# Altium schematic sheet Schematic.SchDoc
size A2; Organization: Protel International P/L; Address1: L3, 12a Rodborough Rd; Address2: Frenchs Forest; Address3: NSW; Address4: Australia 2086
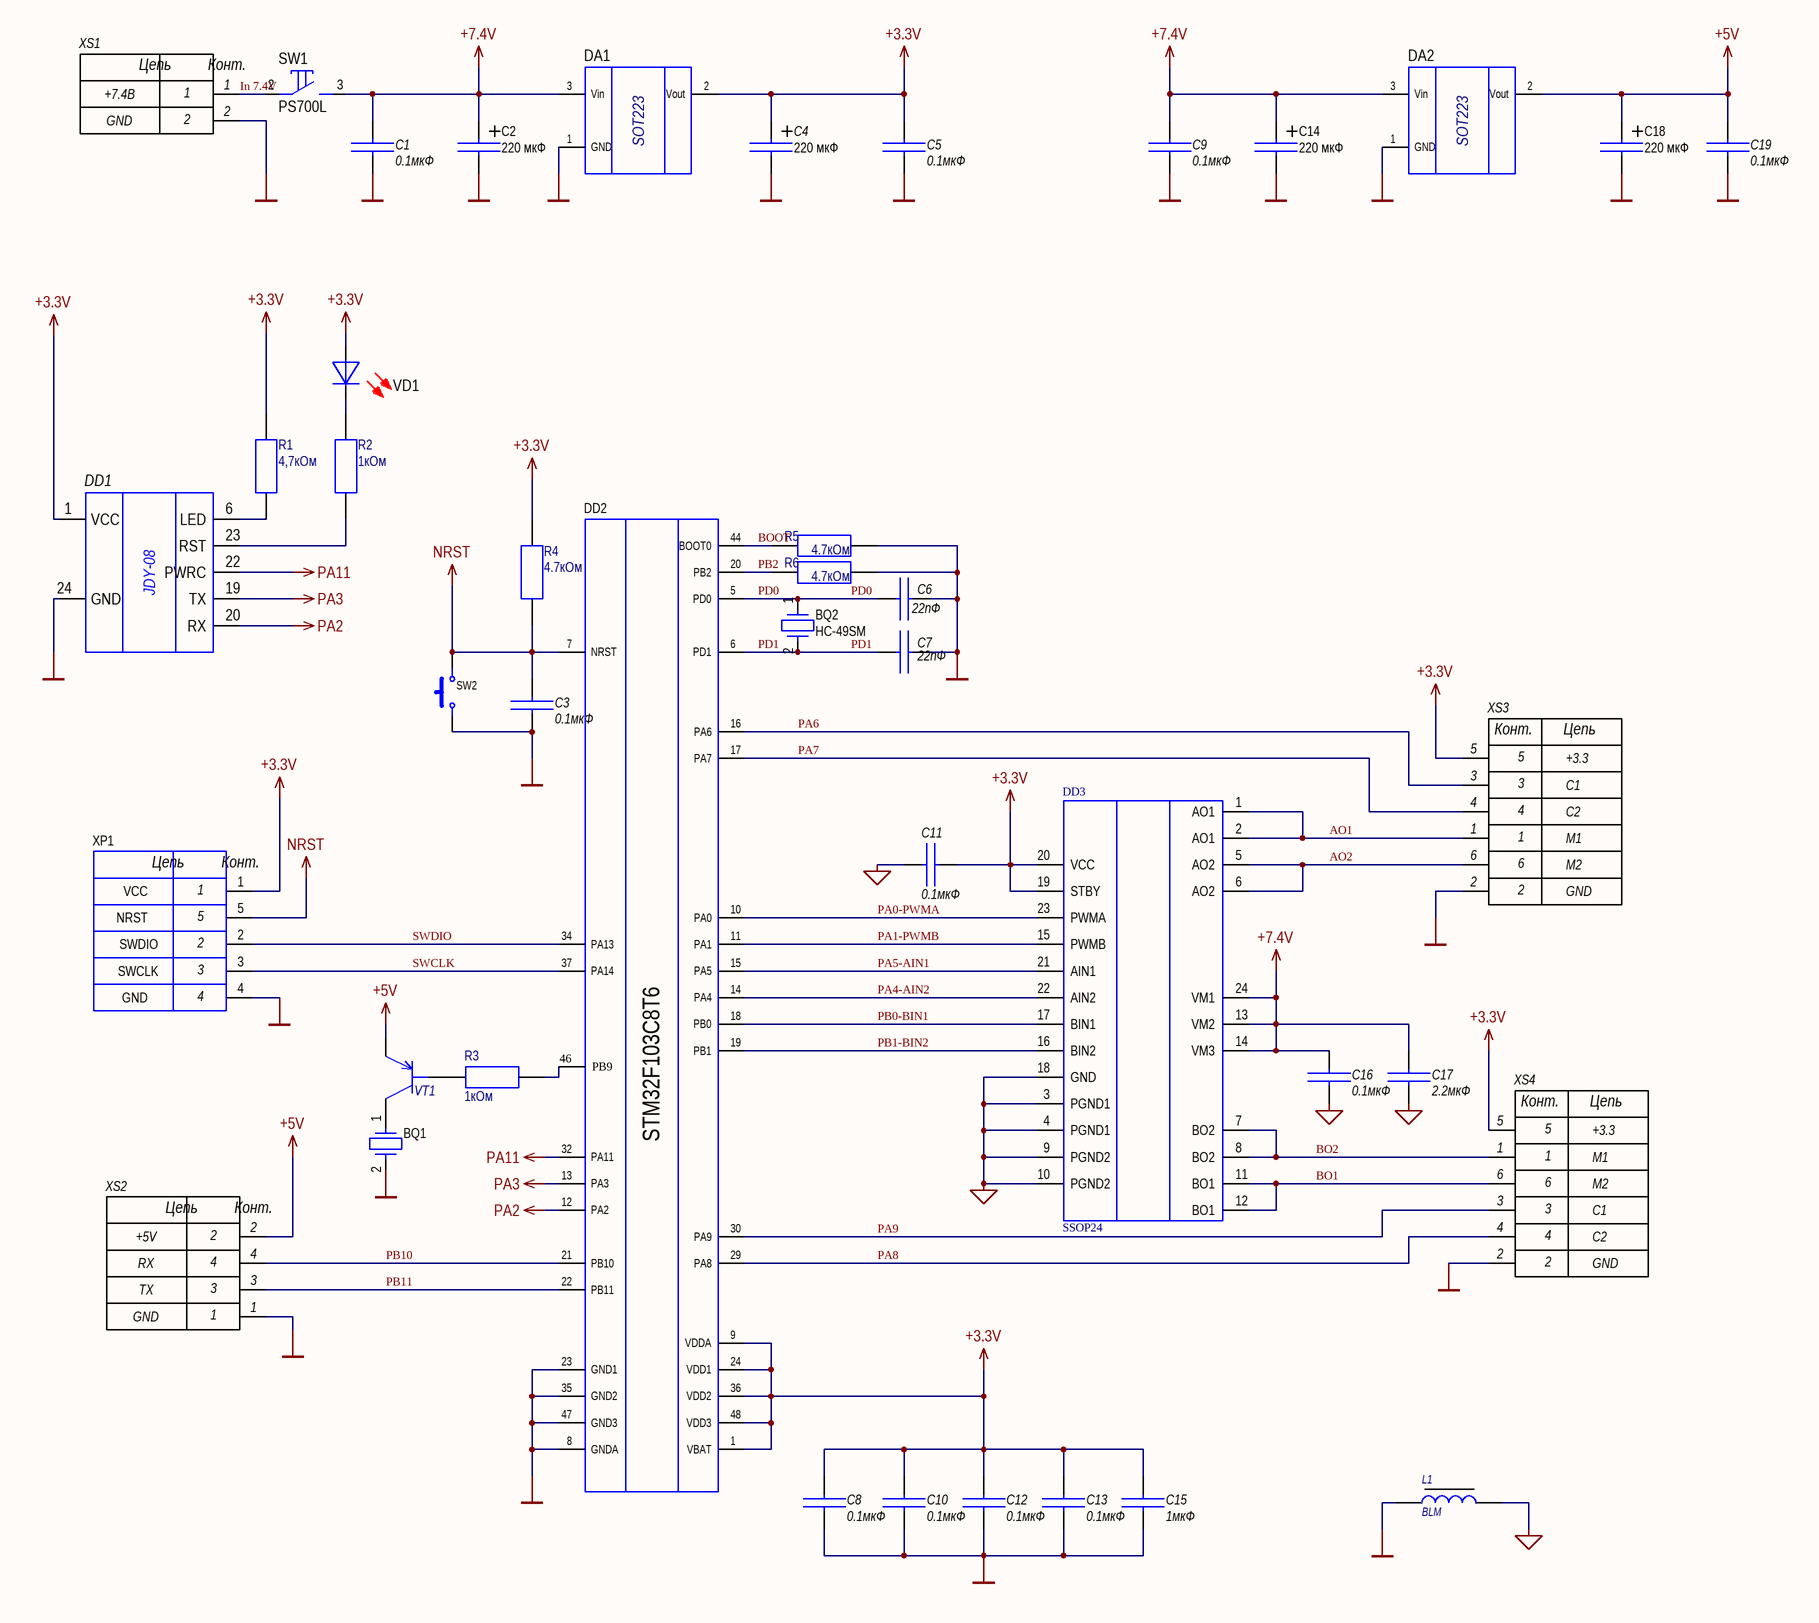
[diagram p0: Schematic.SchDoc]

## Parts
BQ1  (no value)  [buzzer]
BQ2  HC-49SM  [HC-49SM]
C1  value 0.1мкФ  [SMD_0805]  (hidden comment: SMD0805)
C2  value 220 мкФ  [SMD JCK]  (hidden comment: SMD JCK ECAP)
C3  value 0.1мкФ  [SMD_0805]  (hidden comment: SMD0805)
C4  value 220 мкФ  [SMD JCK]  (hidden comment: SMD JCK ECAP)
C5  value 0.1мкФ  [SMD_0805]  (hidden comment: SMD0805)
C6  value 22пФ  [SMD_0805]  (hidden comment: SMD0805)
C7  value 22пФ  [SMD_0805]  (hidden comment: SMD0805)
C8  value 0.1мкФ  [SMD_0805]  (hidden comment: SMD0805)
C9  value 0.1мкФ  [SMD_0805]  (hidden comment: SMD0805)
C10  value 0.1мкФ  [SMD_0805]  (hidden comment: SMD0805)
C11  value 0.1мкФ  [SMD_0805]  (hidden comment: SMD0805)
C12  value 0.1мкФ  [SMD_0805]  (hidden comment: SMD0805)
C13  value 0.1мкФ  [SMD_0805]  (hidden comment: SMD0805)
C14  value 220 мкФ  [SMD JCK]  (hidden comment: SMD JCK ECAP)
C15  value 1мкФ  [SMD_0805]  (hidden comment: SMD0805)
C16  value 0.1мкФ  [SMD_0805]  (hidden comment: SMD0805)
C17  value 2.2мкФ  [SMD_0805]  (hidden comment: SMD0805)
C18  value 220 мкФ  [SMD JCK]  (hidden comment: SMD JCK ECAP)
C19  value 0.1мкФ  [SMD_0805]  (hidden comment: SMD0805)
DA1  SOT223  [SOT-223]
DA2  SOT223  [SOT-223]
DD1  JDY-08  [JDY-08]
DD2  STM32F103C8T6  [LQFP48_L]
DD3  SSOP24  [SSOP24]
L1  BLM  [SMD_0805]
R1  4,7кОм  [SMD0805]
R2  1кОм  [SMD0805]
R3  1кОм  [SMD0805]
R4  4.7кОм  [SMD0805]
R5  4.7кОм  [SMD0805]
R6  4.7кОм  [SMD0805]
SW1  PS700L  [KLS7-P]
SW2  SWITCH  [KLS76x6x4.3]  (value not drawn)
VD1  LED  [SMD 0805]  (value not drawn)
VT1  PNP  [SOT23]  (value not drawn)
XP1  PBD6  [PLD6]  (value not drawn)
XS1  Parameter 1: +7.4В  Parameter 2: GND  [PH2.0-2P]  (hidden comment: PORT)
XS2  P1: +5V  P2: RX  P3: TX  P4: GND  [ph2.0-4P]  (hidden comment: PH2.0-4P)
XS3  (no value)  [ZR1.5-6P]
XS4  (no value)  [ZR1.5-6P]

## Nets
+3.3V: C4.1 C5.2 C8.2 C10.2 C11.2 C12.2 C13.2 C15.2 DA1.2(Vout) DD1.1(VCC) DD2.1(VBAT) DD2.9(VDDA) DD2.24(VDD1) DD2.36(VDD2) DD2.48(VDD3) DD3.19(STBY) DD3.20(VCC) R1.2 R4.2 VD1.1(А) XP1.1(VCC) XS3.5(+3.3) XS4.5(+3.3)
+5V: C18.1 C19.2 DA2.2(Vout) VT1.1(Э) XS2.2
+7.4V: C1.2 C2.1 C9.2 C14.1 C16.2 C17.2 DA1.3(Vin) DA2.3(Vin) DD3.13(VM2) DD3.14(VM3) DD3.24(VM1) SW1.3
AGND: C11.1 C16.1 C17.1 DD3.3(PGND1) DD3.4(PGND1) DD3.9(PGND2) DD3.10(PGND2) DD3.18(GND) L1.2
GND: BQ1.2 C1.1 C2.2 C3.1 C4.2 C5.1 C6.2 C7.2 C8.1 C9.1 C10.1 C12.1 C13.1 C14.2 C15.1 C18.2 C19.1 DA1.1(GND) DA2.1(GND) DD1.24(GND) DD2.8(GNDA) DD2.23(GND1) DD2.35(GND2) DD2.47(GND3) L1.1 R5.2 R6.2 SW2.1 XP1.4(GND) XS1.2 XS2.1 XS3.2(GND) XS4.2(GND)
NRST: C3.2 DD2.7(NRST) R4.1 SW2.2 XP1.5(NRST)
PA2: DD1.20(RX) DD2.12(PA2)
PA3: DD1.19(TX) DD2.13(PA3)
PA11: DD1.22(PWRC) DD2.32(PA11)
AO1: DD3.1(AO1) DD3.2(AO1) XS3.1(M1)
AO2: DD3.5(AO2) DD3.6(AO2) XS3.6(M2)
BO1: DD3.11(BO1) DD3.12(BO1) XS4.6(M2)
BO2: DD3.7(BO2) DD3.8(BO2) XS4.1(M1)
BOOT: DD2.44(BOOT0) R5.1
In 7.4V: SW1.2 XS1.1
PA0-PWMA: DD2.10(PA0) DD3.23(PWMA)
PA1-PWMB: DD2.11(PA1) DD3.15(PWMB)
PA4-AIN2: DD2.14(PA4) DD3.22(AIN2)
PA5-AIN1: DD2.15(PA5) DD3.21(AIN1)
PA6: DD2.16(PA6) XS3.3(C1)
PA7: DD2.17(PA7) XS3.4(C2)
PA8: DD2.29(PA8) XS4.4(C2)
PA9: DD2.30(PA9) XS4.3(C1)
PB0-BIN1: DD2.18(PB0) DD3.17(BIN1)
PB1-BIN2: DD2.19(PB1) DD3.16(BIN2)
PB2: DD2.20(PB2) R6.1
PB10: DD2.21(PB10) XS2.4
PB11: DD2.22(PB11) XS2.3
PD0: BQ2.1 C6.1 DD2.5(PD0)
PD1: BQ2.2 C7.1 DD2.6(PD1)
SWCLK: DD2.37(PA14) XP1.3(SWCLK)
SWDIO: DD2.34(PA13) XP1.2(SWDIO)
NetBQ1_1: BQ1.1 VT1.3(К)
NetDD1_6: DD1.6(LED) R1.1
NetDD1_23: DD1.23(RST) R2.1
NetDD2_46: DD2.46(PB9) R3.2
NetR2_2: R2.2 VD1.2(К)
NetR3_1: R3.1 VT1.2(Б)

## Notes on the sheet
- Title
- Size:
- Date:
- File:
- A2
- Number:
- Time:
- Revision:
- Sheet
- of
- (in symbol PBD6) Цепь; Конт.
- (in symbol PH1.5-6P_1) Конт.; Цепь
- (in symbol PH1.5-6P_2) Конт.; Цепь
- (in symbol PH2.0-2P) Цепь; Конт.
- (in symbol PH2.0-4P) Цепь; Конт.

## Library data of the parts
BQ1 = HC-49SM
C1 C3 C5-C13 C15-C17 C19 = SMD0805: CAP
DD2 = STM32F103C8T6: A/D Converter: 2x12-bit (10 Channel); Core: ARM Cortex-M3; FLASH Size (Prog) (kB): 64; I/Os (High Current): 37; Internal RAM Size (kB): 20; Operating Frequency(F) (Processor speed) (MHz): 72; Packing: Tray; Supply Voltage(Vcc) min (V): 2; DatasheetVersion: Rev. 16; PackageVersion: Rev. 6, 06/2013; PackageReference: LQFP48; PackageDescription: 48-Pin Low Profile Quad Flat Package, 7 x 7 mm Body, 0.5 mm Pitch; Supplier 1: Digi-Key; Supplier Part Number 1: 497-6063-ND; Supplier 2: Farnell; Supplier Part Number 2: 1447637; Supplier 3: Newark; Supplier Part Number 3: 59M2182; Supplier 4: Newark; Supplier Part Number 4: 57P1222; Supplier 5: Mouser; Supplier Part Number 5: 511-STM32F103C8T6; Mounting Technology: Surface Mount; PartNumber: STM32F103C8T6; ComponentLink1Description: Manufacturer URL; ComponentLink1URL: http://www.st.com/web/en/home.html; ComponentLink2Description: Datasheet; ComponentLink2URL: http://www.st.com/st-web-ui/static/active/en/resource/technical/document/datasheet/CD00161566.pdf; ComponentLink3Description: Package Specification; ComponentLink3URL: http://www.st.com/st-web-ui/static/active/en/resource/technical/document/datasheet/DM00058181.pdf
L1 = SMD 0805
R1-R6 = SMD0805
SW1 = KLS7: ComponentLink1Description: datasheet; ComponentLink1URL: https://static.chipdip.ru/lib/054/DOC000054735.pdf
VD1 = SMD 0805: ValueManufacturerPartNumber: LED, *, *, *, -55...+150°C; Manufacturer: *; Package: *; HelpURL: *; Temperature: -55...+150°C; TypeDiode: LED; Current: *; VoltageDrop: *; PartNumber: *
VT1 = PNP: Type: Транзистор; Published: 07.05.2013; Publisher: Andrew Danich
XS1 = PH2.0-2P
XS3 = PH1.5-6P_1
XS4 = PH1.5-6P_2
DA1 DA2 = SOT223: ComponentLink1Description: Datasheet; ComponentLink1URL: https://static.chipdip.ru/lib/029/DOC001029248.pdf
DD1 = JDY-08: ComponentLink1Description: Datasheet; ComponentLink1URL: http://www.farnell.com/datasheets/2236920.pdf
SW2 = SWITCH: ComponentLink1Description: AliExpress; ComponentLink1URL: https://ru.aliexpress.com/item/10PCS-4-4-1-6mm-4x4x1-6H-SMD-push-button-switch-microswitch-Tact-Switch/32731081870.html?spm=a2g0s.9042311.0.0.250233edGDnBBV